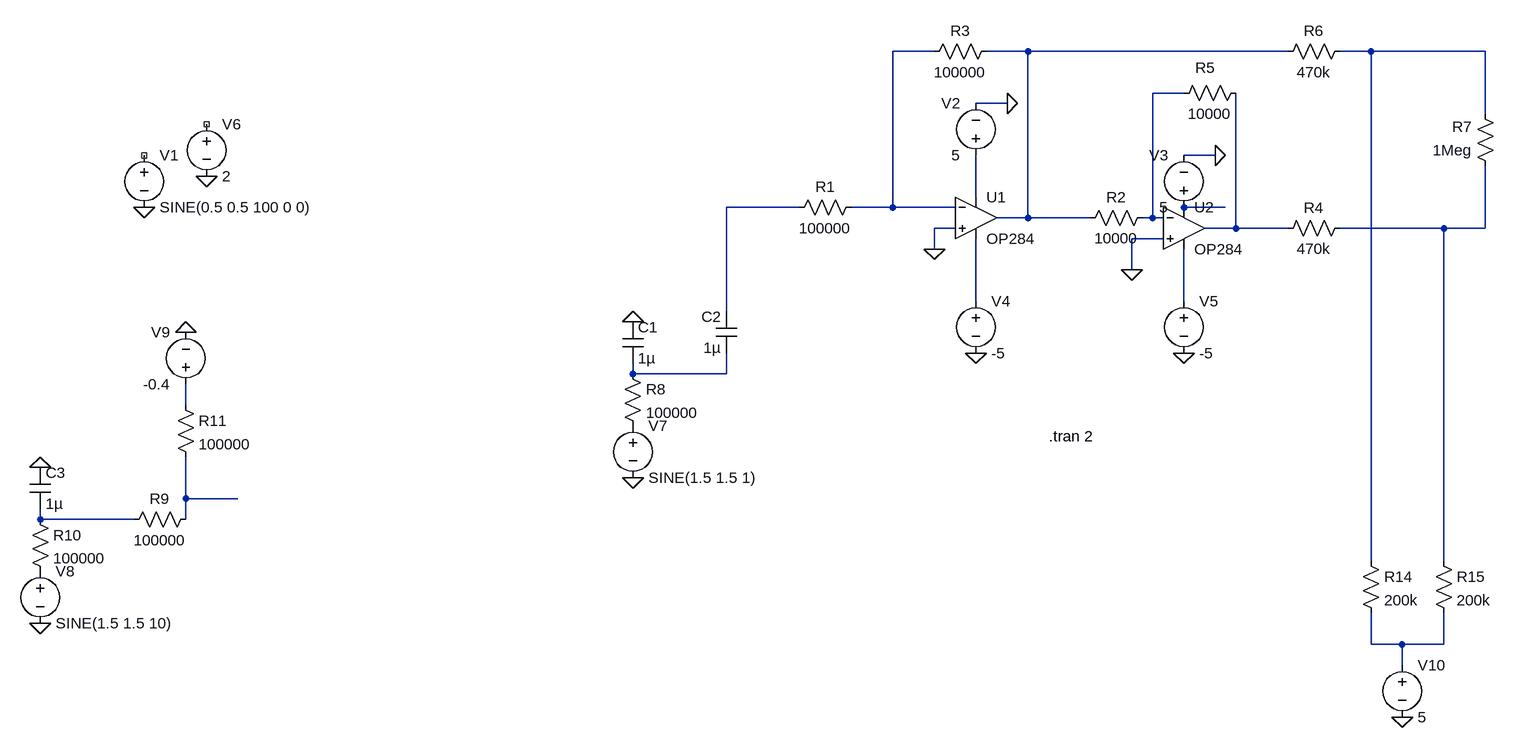
[diagram p0: schematic Ch1FULL_simSchem_10_5_20.asc]
Ch1FULL_simSchem_10_5_20.asc, the LTspice schematic file:
Version 4
SHEET 1 2288 852
WIRE 432 -192 368 -192
WIRE 576 -192 512 -192
WIRE 976 -192 576 -192
WIRE 1104 -192 1056 -192
WIRE 1280 -192 1104 -192
WIRE 816 -128 768 -128
WIRE 544 -112 496 -112
WIRE 1280 -96 1280 -192
WIRE 864 -32 816 -32
WIRE 496 32 496 -32
WIRE 224 48 112 48
WIRE 368 48 368 -192
WIRE 368 48 304 48
WIRE 464 48 368 48
WIRE 880 48 816 48
WIRE 576 64 576 -192
WIRE 576 64 528 64
WIRE 672 64 576 64
WIRE 768 64 768 -128
WIRE 768 64 752 64
WIRE 784 64 768 64
WIRE 464 80 432 80
WIRE 896 80 896 -128
WIRE 896 80 848 80
WIRE 976 80 896 80
WIRE 1216 80 1056 80
WIRE 1280 80 1280 -16
WIRE 1280 80 1216 80
WIRE 784 96 736 96
WIRE 432 112 432 80
WIRE 736 144 736 96
WIRE 496 192 496 96
WIRE 816 192 816 112
WIRE 112 208 112 48
WIRE -32 304 -32 288
WIRE 112 304 112 272
WIRE 112 304 -32 304
WIRE -720 352 -720 320
WIRE -720 496 -720 432
WIRE -640 496 -720 496
WIRE -944 528 -944 512
WIRE -800 528 -944 528
WIRE -720 528 -720 496
WIRE 1104 592 1104 -192
WIRE 1216 592 1216 80
WIRE 1104 720 1104 672
WIRE 1152 720 1104 720
WIRE 1216 720 1216 672
WIRE 1216 720 1152 720
WIRE 1152 752 1152 720
FLAG 432 112 0
FLAG 736 144 0
FLAG -784 48 0
FLAG 496 272 0
FLAG 816 272 0
FLAG 864 -32 0
FLAG 544 -112 0
FLAG -688 0 0
FLAG -32 464 0
FLAG -32 224 0
FLAG -944 688 0
FLAG -944 448 0
FLAG -720 240 0
FLAG 1152 832 0
SYMBOL voltage -784 -48 R0
WINDOW 123 0 0 Left 0
WINDOW 39 0 0 Left 0
SYMATTR InstName V1
SYMATTR Value SINE(0.5 0.5 100 0 0)
SYMBOL res 320 32 R90
WINDOW 0 0 56 VBottom 2
WINDOW 3 32 56 VTop 2
SYMATTR InstName R1
SYMATTR Value 100000
SYMBOL Opamps\\OP284 496 0 R0
SYMATTR InstName U1
SYMBOL Opamps\\OP284 816 16 R0
SYMATTR InstName U2
SYMBOL res 768 48 R90
WINDOW 0 0 56 VBottom 2
WINDOW 3 32 56 VTop 2
SYMATTR InstName R2
SYMATTR Value 10000
SYMBOL res 528 -208 R90
WINDOW 0 0 56 VBottom 2
WINDOW 3 32 56 VTop 2
SYMATTR InstName R3
SYMATTR Value 100000
SYMBOL res 912 -144 R90
WINDOW 0 -7 63 VBottom 2
WINDOW 3 32 56 VTop 2
SYMATTR InstName R5
SYMATTR Value 10000
SYMBOL voltage 496 -16 R180
WINDOW 0 24 96 Left 2
WINDOW 3 24 16 Left 2
WINDOW 123 0 0 Left 0
WINDOW 39 0 0 Left 0
SYMATTR InstName V2
SYMATTR Value 5
SYMBOL voltage 816 64 R180
WINDOW 0 24 96 Left 2
WINDOW 3 24 16 Left 2
WINDOW 123 0 0 Left 0
WINDOW 39 0 0 Left 0
SYMATTR InstName V3
SYMATTR Value 5
SYMBOL res 1072 -208 R90
WINDOW 0 0 56 VBottom 2
WINDOW 3 32 56 VTop 2
SYMATTR InstName R6
SYMATTR Value 470k
SYMBOL res 1296 0 R180
WINDOW 0 36 76 Left 2
WINDOW 3 36 40 Left 2
SYMATTR InstName R7
SYMATTR Value 1Meg
SYMBOL res 1072 64 R90
WINDOW 0 0 56 VBottom 2
WINDOW 3 32 56 VTop 2
SYMATTR InstName R4
SYMATTR Value 470k
SYMBOL voltage 496 176 R0
WINDOW 123 0 0 Left 0
WINDOW 39 0 0 Left 0
SYMATTR InstName V4
SYMATTR Value -5
SYMBOL voltage 816 176 R0
WINDOW 123 0 0 Left 0
WINDOW 39 0 0 Left 0
SYMATTR InstName V5
SYMATTR Value -5
SYMBOL voltage -688 -96 R0
WINDOW 123 0 0 Left 0
WINDOW 39 0 0 Left 0
SYMATTR InstName V6
SYMATTR Value 2
SYMBOL voltage -32 368 R0
WINDOW 123 0 0 Left 0
WINDOW 39 0 0 Left 0
SYMATTR InstName V7
SYMATTR Value SINE(1.5 1.5 1)
SYMBOL res -48 288 R0
SYMATTR InstName R8
SYMATTR Value 100000
SYMBOL cap -48 224 R0
SYMATTR InstName C1
SYMATTR Value 1µ
SYMBOL cap 128 272 R180
WINDOW 0 24 56 Left 2
WINDOW 3 24 8 Left 2
SYMATTR InstName C2
SYMATTR Value 1µ
SYMBOL res -704 512 R90
WINDOW 0 0 56 VBottom 2
WINDOW 3 32 56 VTop 2
SYMATTR InstName R9
SYMATTR Value 100000
SYMBOL voltage -944 592 R0
WINDOW 123 0 0 Left 0
WINDOW 39 0 0 Left 0
SYMATTR InstName V8
SYMATTR Value SINE(1.5 1.5 10)
SYMBOL res -960 512 R0
SYMATTR InstName R10
SYMATTR Value 100000
SYMBOL cap -960 448 R0
SYMATTR InstName C3
SYMATTR Value 1µ
SYMBOL res -736 336 R0
SYMATTR InstName R11
SYMATTR Value 100000
SYMBOL voltage -720 336 R180
WINDOW 0 24 96 Left 2
WINDOW 3 24 16 Left 2
WINDOW 123 0 0 Left 0
WINDOW 39 0 0 Left 0
SYMATTR InstName V9
SYMATTR Value -0.4
SYMBOL res 1088 576 R0
SYMATTR InstName R14
SYMATTR Value 200k
SYMBOL res 1200 576 R0
SYMATTR InstName R15
SYMATTR Value 200k
SYMBOL voltage 1152 736 R0
WINDOW 123 0 0 Left 0
WINDOW 39 0 0 Left 0
SYMATTR InstName V10
SYMATTR Value 5
TEXT 608 400 Left 2 !.tran 2

The netlist it stands for:
* Ch1FULL_simSchem_10_5_20.asc
V1 NC_01 0 SINE(0.5 0.5 100 0 0)
R1 N001 N006 100000
XU1 0 N001 N005 N010 N002 OP284  ; pins In+ In- V+ V- OUT
XU2 0 N004 N007 N011 N008 OP284  ; pins In+ In- V+ V- OUT
R2 N004 N002 10000
R3 N002 N001 100000
R5 N008 N004 10000
V2 N005 0 5
V3 N007 0 5
R6 N003 N002 470k
R7 N009 N003 1Meg
R4 N009 N008 470k
V4 N010 0 -5
V5 N011 0 -5
V6 NC_02 0 2
V7 P001 0 SINE(1.5 1.5 1)
R8 N012 P001 100000
C1 0 N012 1µ
C2 N012 N006 1µ
R9 N014 N015 100000
V8 P002 0 SINE(1.5 1.5 10)
R10 N015 P002 100000
C3 0 N015 1µ
R11 N013 N014 100000
V9 N013 0 -0.4
R14 N003 N016 200k
R15 N009 N016 200k
V10 N016 0 5
.tran 2
.lib ADI1.lib
.backanno
.end